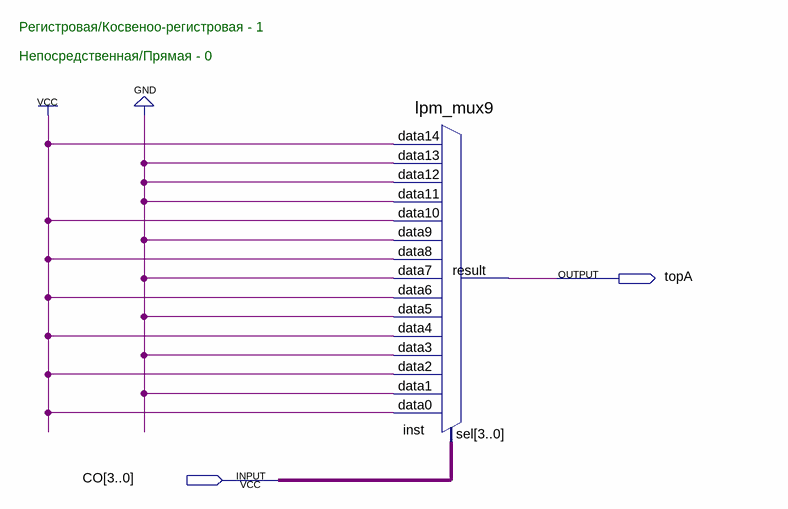
[diagram p0: schematic sheet]
// Quartus schematic ChooseTopA.bdf as structural Verilog: 1 symbols, 2 pins
module ChooseTopA (
  input  [3:0] CO,
  output topA
);

  lpm_mux9 inst (
    .data14(1'b1), .data13(1'b0), .data12(1'b0), .data11(1'b0), .data10(1'b1), .data9(1'b0), .data8(1'b1),
    .data7(1'b0), .data6(1'b1), .data5(1'b0), .data4(1'b1), .data3(1'b0), .data2(1'b1), .data1(1'b0),
    .data0(1'b1), .sel(CO), .result(topA));

  // Notes on the sheet:
  //   Регистровая/Косвеноо-регистровая - 1
  //   Непосредственная/Прямая - 0
endmodule
